# EAGLE schematic 10ma-rcbo-and-anti-external-cb-trip (EAGLE 7.5.0)
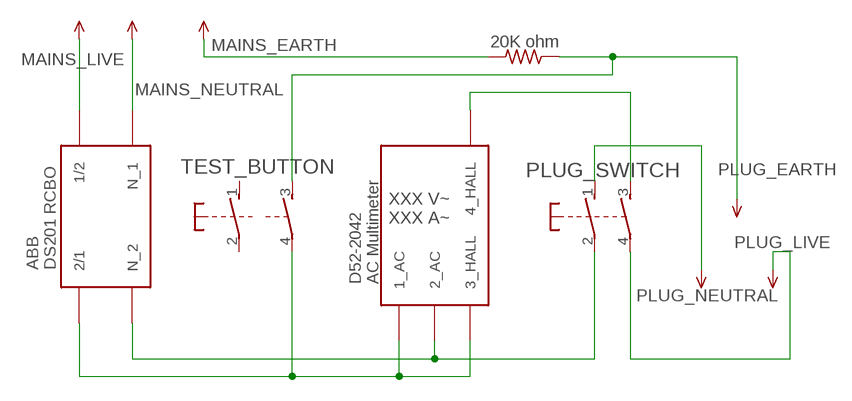
[diagram p0: schematic, sheet 1]

## Parts
R1  20K ohm  R-US_0207/10  [0207/10]
S1  PVA1  [PVA1F]
S2  PVA1  [PVA1F]
U$1  AC_MULTIMETER  (no package)
U$2  DS201  (no package)

## Nets
N$1: S2.4(2:P) U$1.1_AC U$1.3_HALL U$2.2/1
N$4: S1.2(1:P) U$1.2_AC U$2.N_2
N$5: S1.3(2:S) U$1.4_HALL
V: R1.1 R1.2 S1.1(1:S) S1.4(2:P) S2.3(2:S) U$2.1/2 U$2.N_1
Unconnected: S2.1(1:S) S2.2(1:P)

## Notes on the sheet
- TEST_BUTTON | PLUG_SWITCH

## Library data of the parts
R1 = resistor:R-US_: RESISTOR, American symbol
S1 S2 = switch-misc:PVA1: ITT SWITCH
U$1 = d52-2042:AC_MULTIMETER
U$2 = ds201:DS201